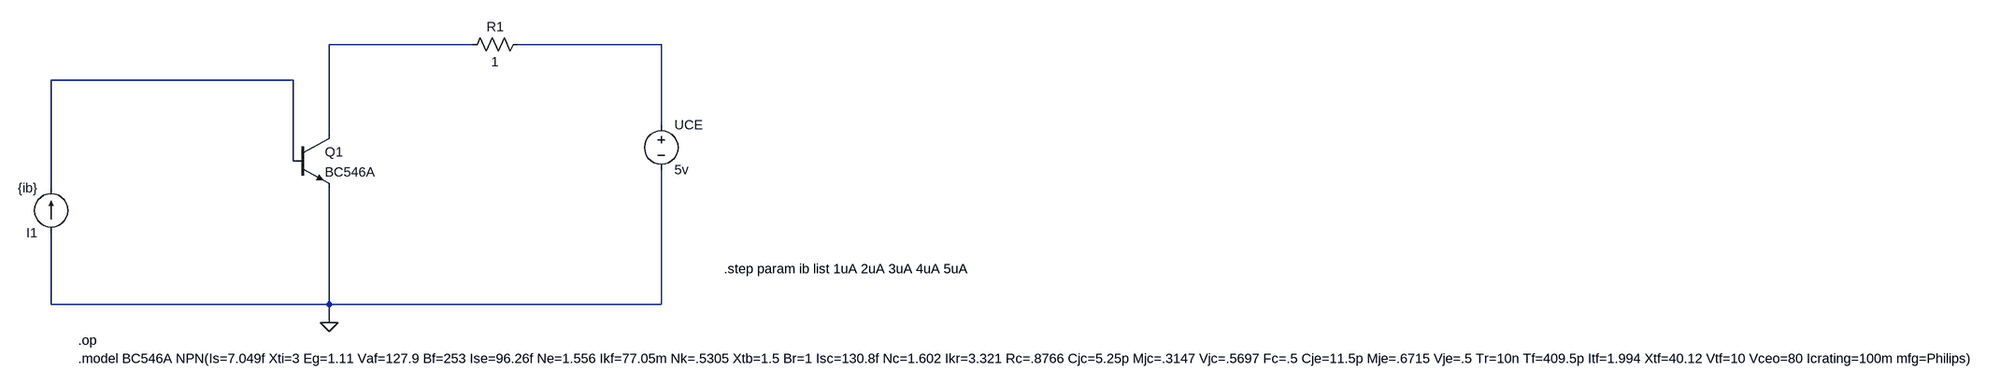
[diagram p0: schematic transistorCkt.asc]
transistorCkt.asc, the LTspice schematic file:
Version 4
SHEET 1 3636 700
WIRE 480 -80 224 -80
WIRE 816 -80 560 -80
WIRE 160 -16 -272 -16
WIRE 816 64 816 -80
WIRE 224 80 224 -80
WIRE 160 128 160 -16
WIRE -272 176 -272 -16
WIRE -272 384 -272 256
WIRE 224 384 224 176
WIRE 224 384 -272 384
WIRE 816 384 816 144
WIRE 816 384 224 384
WIRE 224 416 224 384
FLAG 224 416 0
SYMBOL npn 160 80 R0
SYMATTR InstName Q1
SYMATTR Value BC546A
SYMBOL voltage 816 48 R0
WINDOW 123 0 0 Left 0
WINDOW 39 0 0 Left 0
SYMATTR InstName UCE
SYMATTR Value 5v
SYMBOL current -272 256 R180
WINDOW 123 0 0 Left 0
WINDOW 39 0 0 Left 0
SYMATTR InstName I1
SYMATTR Value {ib}
SYMBOL res 576 -96 R90
WINDOW 0 0 56 VBottom 2
WINDOW 3 32 56 VTop 2
SYMATTR InstName R1
SYMATTR Value 1
TEXT -224 480 Left 2 !.model BC546A NPN(Is=7.049f Xti=3 Eg=1.11 Vaf=127.9 Bf=253 Ise=96.26f Ne=1.556 Ikf=77.05m Nk=.5305 Xtb=1.5 Br=1 Isc=130.8f Nc=1.602 Ikr=3.321 Rc=.8766 Cjc=5.25p Mjc=.3147 Vjc=.5697 Fc=.5 Cje=11.5p Mje=.6715 Vje=.5 Tr=10n Tf=409.5p Itf=1.994 Xtf=40.12 Vtf=10 Vceo=80 Icrating=100m mfg=Philips)
TEXT -224 448 Left 2 !.op
TEXT 928 320 Left 2 !.step param ib list 1uA 2uA 3uA 4uA 5uA

The netlist it stands for:
* transistorCkt.asc
Q1 N001 N003 0 0 BC546A
V§UCE N002 0 5v
I1 0 N003 {ib}
R1 N002 N001 1
.model NPN NPN
.model PNP PNP
.lib standard.bjt
.model BC546A NPN(Is=7.049f Xti=3 Eg=1.11 Vaf=127.9 Bf=253 Ise=96.26f Ne=1.556 Ikf=77.05m Nk=.5305 Xtb=1.5 Br=1 Isc=130.8f Nc=1.602 Ikr=3.321 Rc=.8766 Cjc=5.25p Mjc=.3147 Vjc=.5697 Fc=.5 Cje=11.5p Mje=.6715 Vje=.5 Tr=10n Tf=409.5p Itf=1.994 Xtf=40.12 Vtf=10 Vceo=80 Icrating=100m mfg=Philips)
.op
.step param ib list 1uA 2uA 3uA 4uA 5uA
.backanno
.end